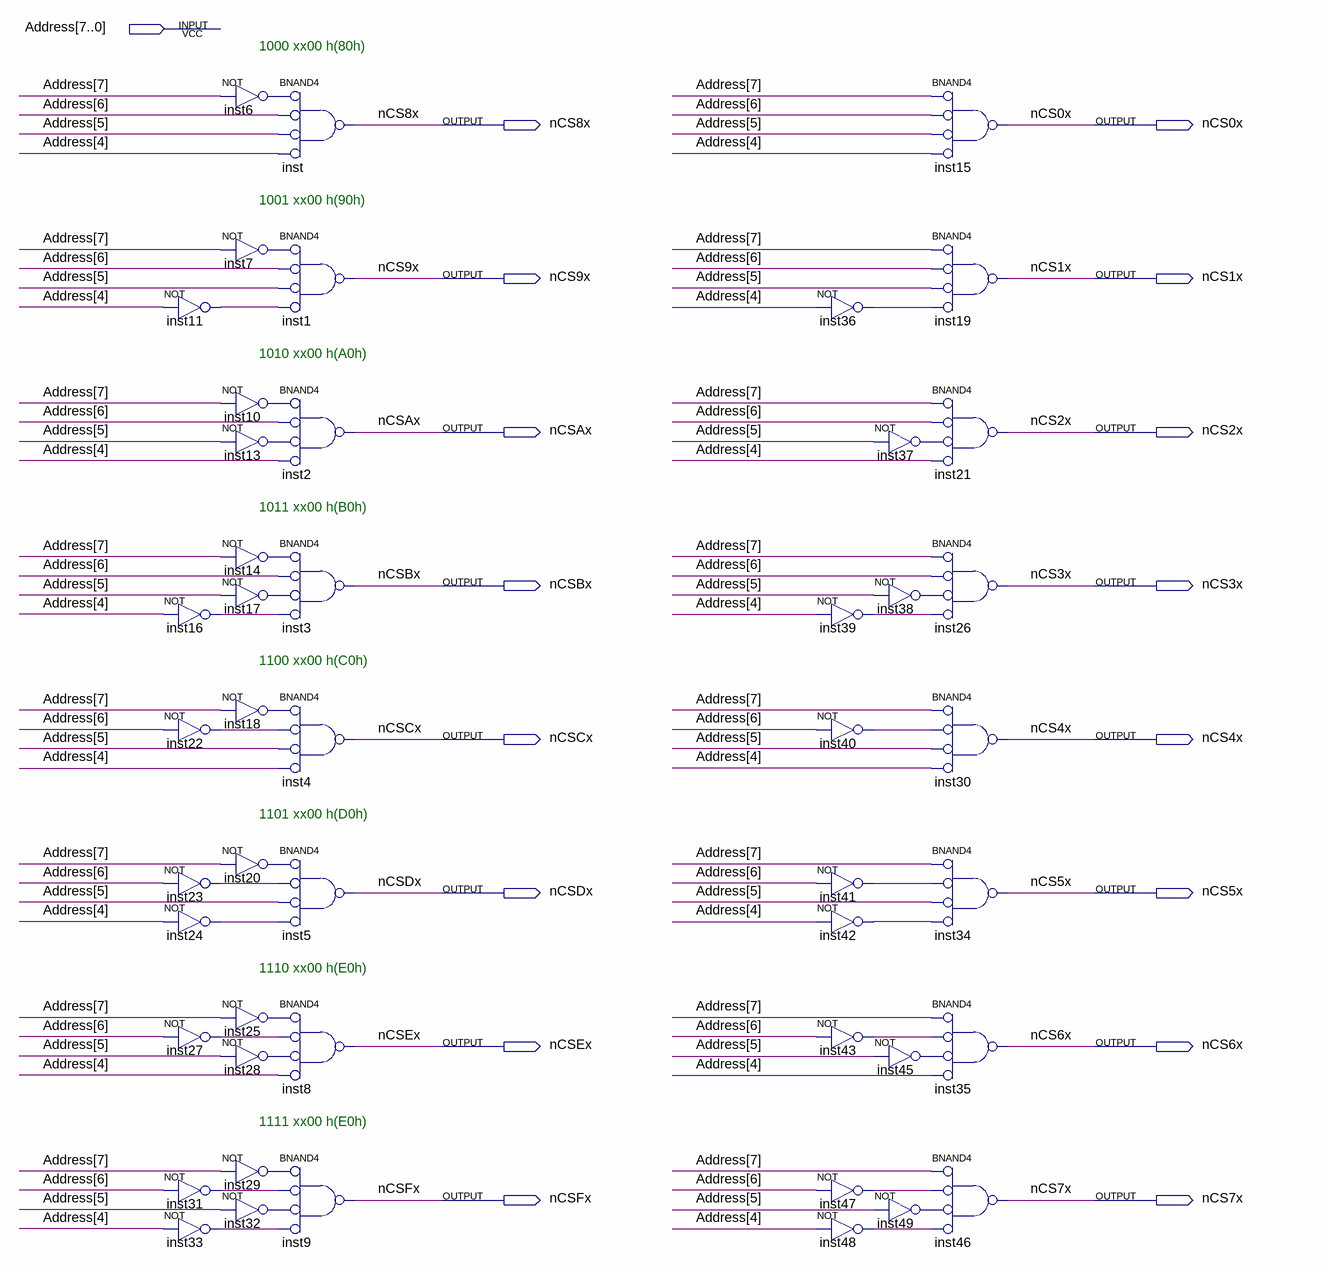
[diagram p0: schematic sheet]
// Quartus schematic Decode10.bdf as structural Verilog: 48 symbols, 17 pins
module Decode10 (
  input  [7:0] Address,
  output nCS8x,
  output nCS0x,
  output nCS9x,
  output nCS1x,
  output nCSAx,
  output nCS2x,
  output nCSBx,
  output nCS3x,
  output nCSCx,
  output nCS4x,
  output nCSDx,
  output nCS5x,
  output nCSEx,
  output nCS6x,
  output nCSFx,
  output nCS7x
);

  wire inst6_out, inst7_out, inst10_out, inst11_out, inst13_out, inst14_out, inst16_out, inst17_out,
       inst18_out, inst20_out, inst22_out, inst23_out, inst24_out, inst25_out, inst27_out, inst28_out,
       inst29_out, inst31_out, inst32_out, inst33_out, inst36_out, inst37_out, inst38_out, inst39_out,
       inst40_out, inst41_out, inst42_out, inst43_out, inst45_out, inst47_out, inst48_out, inst49_out;

  not inst11 (inst11_out, Address[4]);
  not inst16 (inst16_out, Address[4]);
  not inst22 (inst22_out, Address[6]);
  not inst23 (inst23_out, Address[6]);
  not inst24 (inst24_out, Address[4]);
  not inst27 (inst27_out, Address[6]);
  not inst31 (inst31_out, Address[6]);
  not inst33 (inst33_out, Address[4]);
  not inst6 (inst6_out, Address[7]);
  nand inst (nCS8x, ~inst6_out, ~Address[6], ~Address[5], ~Address[4]);  // BNAND4
  not inst7 (inst7_out, Address[7]);
  nand inst1 (nCS9x, ~inst7_out, ~Address[6], ~Address[5], ~inst11_out);  // BNAND4
  not inst10 (inst10_out, Address[7]);
  nand inst2 (nCSAx, ~inst10_out, ~Address[6], ~inst13_out, ~Address[4]);  // BNAND4
  not inst13 (inst13_out, Address[5]);
  not inst14 (inst14_out, Address[7]);
  nand inst3 (nCSBx, ~inst14_out, ~Address[6], ~inst17_out, ~inst16_out);  // BNAND4
  not inst17 (inst17_out, Address[5]);
  not inst18 (inst18_out, Address[7]);
  nand inst4 (nCSCx, ~inst18_out, ~inst22_out, ~Address[5], ~Address[4]);  // BNAND4
  not inst20 (inst20_out, Address[7]);
  nand inst5 (nCSDx, ~inst20_out, ~inst23_out, ~Address[5], ~inst24_out);  // BNAND4
  not inst25 (inst25_out, Address[7]);
  nand inst8 (nCSEx, ~inst25_out, ~inst27_out, ~inst28_out, ~Address[4]);  // BNAND4
  not inst28 (inst28_out, Address[5]);
  not inst29 (inst29_out, Address[7]);
  nand inst9 (nCSFx, ~inst29_out, ~inst31_out, ~inst32_out, ~inst33_out);  // BNAND4
  not inst32 (inst32_out, Address[5]);
  not inst36 (inst36_out, Address[4]);
  not inst39 (inst39_out, Address[4]);
  not inst40 (inst40_out, Address[6]);
  not inst41 (inst41_out, Address[6]);
  not inst42 (inst42_out, Address[4]);
  not inst43 (inst43_out, Address[6]);
  not inst47 (inst47_out, Address[6]);
  not inst48 (inst48_out, Address[4]);
  not inst37 (inst37_out, Address[5]);
  not inst38 (inst38_out, Address[5]);
  not inst45 (inst45_out, Address[5]);
  not inst49 (inst49_out, Address[5]);
  nand inst15 (nCS0x, ~Address[7], ~Address[6], ~Address[5], ~Address[4]);  // BNAND4
  nand inst19 (nCS1x, ~Address[7], ~Address[6], ~Address[5], ~inst36_out);  // BNAND4
  nand inst21 (nCS2x, ~Address[7], ~Address[6], ~inst37_out, ~Address[4]);  // BNAND4
  nand inst26 (nCS3x, ~Address[7], ~Address[6], ~inst38_out, ~inst39_out);  // BNAND4
  nand inst30 (nCS4x, ~Address[7], ~inst40_out, ~Address[5], ~Address[4]);  // BNAND4
  nand inst34 (nCS5x, ~Address[7], ~inst41_out, ~Address[5], ~inst42_out);  // BNAND4
  nand inst35 (nCS6x, ~Address[7], ~inst43_out, ~inst45_out, ~Address[4]);  // BNAND4
  nand inst46 (nCS7x, ~Address[7], ~inst47_out, ~inst49_out, ~inst48_out);  // BNAND4

  // Notes on the sheet:
  //   1000 xx00 h(80h)
  //   1001 xx00 h(90h)
  //   1010 xx00 h(A0h)
  //   1011 xx00 h(B0h)
  //   1100 xx00 h(C0h)
  //   1101 xx00 h(D0h)
  //   1110 xx00 h(E0h)
  //   1111 xx00 h(E0h)
endmodule
